# Altium schematic sheet RS485_INTERFACE.SchDoc
size A4
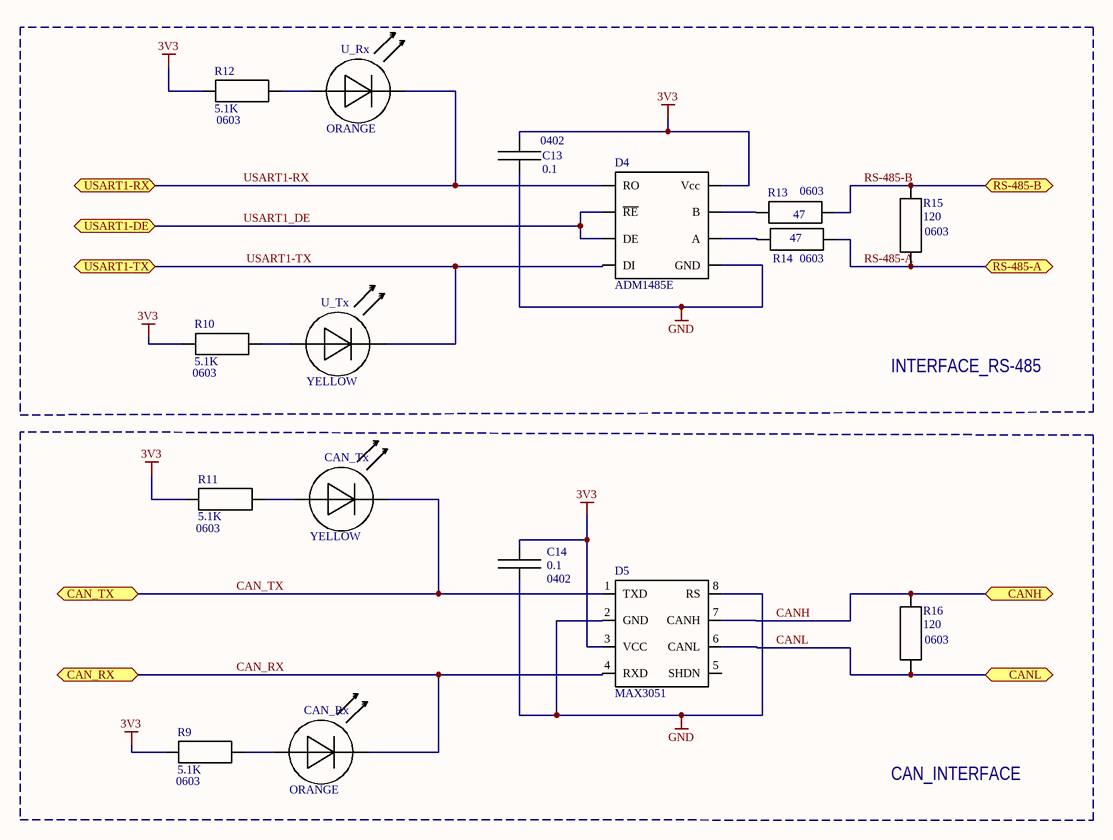
[diagram p0: RS485_INTERFACE.SchDoc]

## Parts
C13  0.1  [SMD_0402_C]
C14  0.1  [SMD_0402_C]
CAN_Rx  ORANGE  [SMD_LED_2012]
CAN_Tx  YELLOW  [SMD_LED]
D4  ADM1485E  [SOIC_N 8-Lead]
D5  MAX3051  [SOIC_N 8-Lead]
R9  5.1K  [SMD_0603]
R10  5.1K  [SMD_0603]
R11  5.1K  [SMD_0603]
R12  5.1K  [SMD_0603]
R13  47  [SMD_0603]
R14  47  [SMD_0603]
R15  120  [SMD_0603]
R16  120  [SMD_0603]
U_Rx  ORANGE  [SMD_LED_2012]
U_Tx  YELLOW  [SMD_LED]

## Blocks framed on the sheet
INTERFACE_RS-485: C13 D4 R10 R12-R15 U_Rx U_Tx
CAN_INTERFACE: C14 CAN_Rx CAN_Tx D5 R9 R11 R16

## Ports
CAN_RX, CAN_TX, CANH, CANL, RS-485-A, RS-485-B, USART1-DE, USART1-RX, USART1-TX

## Nets
3V3: C13.2 C14.2 D4.8(Vcc) D5.3(VCC) R9.1 R10.1 R11.1 R12.1
GND: C13.1 C14.1 D4.5(GND) D5.2(GND) D5.8(RS)
CAN_RX: CAN_Rx.1 D5.4(RXD) ; port CAN_RX
CAN_TX: CAN_Tx.1 D5.1(TXD) ; port CAN_TX
CANH: D5.7(CANH) R16.2 ; port CANH
CANL: D5.6(CANL) R16.1 ; port CANL
RS-485-A: R14.2 R15.1 ; port RS-485-A
RS-485-B: R13.2 R15.2 ; port RS-485-B
USART1-RX: D4.1(RO) U_Rx.1 ; port USART1-RX
USART1-TX: D4.4(DI) U_Tx.1 ; port USART1-TX
USART1_DE: D4.2(~{RE}) D4.3(DE) ; port USART1-DE
NetCAN_Rx_2: CAN_Rx.2 R9.2
NetCAN_Tx_2: CAN_Tx.2 R11.2
NetD4_6: D4.6(A) R14.1
NetD4_7: D4.7(B) R13.1
NetR10_2: R10.2 U_Tx.2
NetR12_2: R12.2 U_Rx.2

Not connected (* = marked no-connect by the designer): D5 5(SHDN)

## Notes on the sheet
- (near R12) 0603
- (near C13) 0402
- (near R13) 0603
- (near R14) 0603
- (near R15) 0603
- (near R10) 0603
- (near R11) 0603
- 0402
- (near R16) 0603
- (near R9) 0603

## Library data of the parts
C13 C14 = Capacitor
CAN_Rx CAN_Tx U_Rx U_Tx = LED_Diode
D5 = MAX3051: CAN Transeiver, 3.3V, 1Mbps, 8pin
R9-R12 R16 = Resistor: 0603 resistor
R13-R15 = Resistor